# EAGLE design test1.2sch (EAGLE 9.6.2)
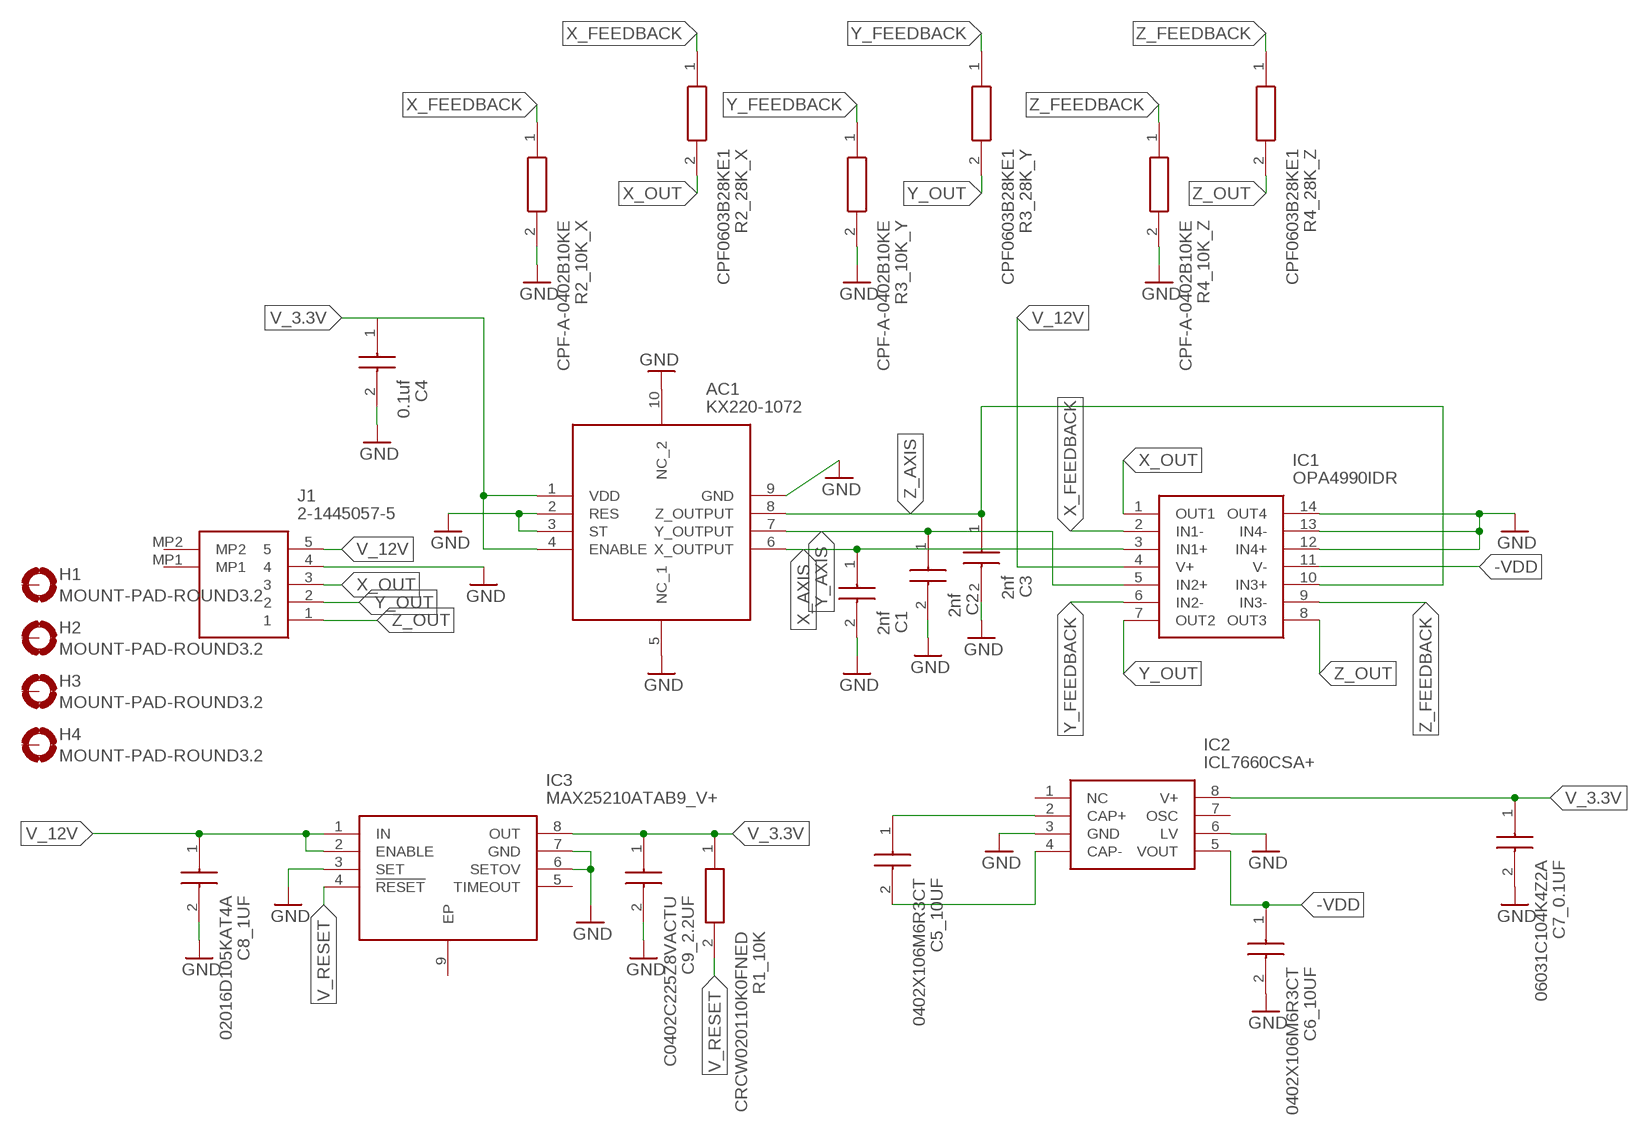
[diagram p0: schematic, sheet 1]

## Parts
AC1  KX220-1072  [KX2201072]
C1  2nf  C0402C202J3GACTU  [CAPC1005X60N]
C2  2nf  C0402C202J3GACTU  [CAPC1005X60N]
C3  2nf  C0402C202J3GACTU  [CAPC1005X60N]
C4  0.1uf  06031C104K4Z2A  [CAPC1608X90N]
C5_10UF  0402X106M6R3CT  [CAPC1005X55N]
C6_10UF  0402X106M6R3CT  [CAPC1005X55N]
C7_0.1UF  06031C104K4Z2A  [CAPC1608X90N]
C8_1UF  02016D105KAT4A  [CAPC0603X33N]
C9_2.2UF  C0402C225Z8VACTU  [INDC1005X55N]
H1  MOUNT-PAD-ROUND3.2  [3,2-PAD]
H2  MOUNT-PAD-ROUND3.2  [3,2-PAD]
H3  MOUNT-PAD-ROUND3.2  [3,2-PAD]
H4  MOUNT-PAD-ROUND3.2  [3,2-PAD]
IC1  OPA4990IDR  [SOIC127P600X175-14N]
IC2  ICL7660CSA+  [SOIC127P600X175-8N]
IC3  MAX25210ATAB9_V+  [SON65P300X300X80-9N]
J1  2-1445057-5  [214450575]
R1_10K  CRCW020110K0FNED  [RESC0603X28N]
R2_10K_X  CPF-A-0402B10KE  [RESC1005X35N]
R2_28K_X  CPF0603B28KE1  [RESC1608X55N]
R3_10K_Y  CPF-A-0402B10KE  [RESC1005X35N]
R3_28K_Y  CPF0603B28KE1  [RESC1608X55N]
R4_10K_Z  CPF-A-0402B10KE  [RESC1005X35N]
R4_28K_Z  CPF0603B28KE1  [RESC1608X55N]

## Nets
-VDD: C6_10UF.1 IC1.11(V-) IC2.5(VOUT)
GND: AC1.2(RES) AC1.3(ST) AC1.5(NC_1) AC1.9(GND) AC1.10(NC_2) C1.2(C2) C2.2(C2) C3.2(C2) C4.2 C6_10UF.2 C7_0.1UF.2 C8_1UF.2 C9_2.2UF.2 IC1.12(IN4+) IC1.13(IN4-) IC1.14(OUT4) IC2.3(GND) IC2.6(LV) IC3.3(SET) IC3.6(SETOV) IC3.7(GND) J1.4 R2_10K_X.2 R3_10K_Y.2 R4_10K_Z.2
N$1: C5_10UF.1 IC2.2(CAP+)
N$2: C5_10UF.2 IC2.4(CAP-)
V_3.3V: AC1.1(VDD) AC1.4(ENABLE) C4.1 C7_0.1UF.1 C9_2.2UF.1 IC2.8(V+) IC3.8(OUT) R1_10K.1
V_12V: C8_1UF.1 IC1.4(V+) IC3.1(IN) IC3.2(ENABLE) J1.5
V_RESET: IC3.4(!RESET) R1_10K.2
X_AXIS: AC1.6(X_OUTPUT) C1.1(C1) IC1.3(IN1+)
X_FEEDBACK: IC1.2(IN1-) R2_10K_X.1 R2_28K_X.1
X_OUT: IC1.1(OUT1) J1.3 R2_28K_X.2
Y_AXIS: AC1.7(Y_OUTPUT) C2.1(C1) IC1.5(IN2+)
Y_FEEDBACK: IC1.6(IN2-) R3_10K_Y.1 R3_28K_Y.1
Y_OUT: IC1.7(OUT2) J1.2 R3_28K_Y.2
Z_AXIS: AC1.8(Z_OUTPUT) C3.1(C1) IC1.10(IN3+)
Z_FEEDBACK: IC1.9(IN3-) R4_10K_Z.1 R4_28K_Z.1
Z_OUT: IC1.8(OUT3) J1.1 R4_28K_Z.2
Unconnected: H1.B3,2(MOUNT) H2.B3,2(MOUNT) H3.B3,2(MOUNT) H4.B3,2(MOUNT) IC2.1(NC) IC2.7(OSC) IC3.5(TIMEOUT) IC3.9(EP) J1.MP1 J1.MP2

## Library data of the parts
AC1 = SamacSys_Parts:KX220-1072: MEMS ACCELEROMETERS, 40G; MEMS Sensor Output:Analogue; Measurement Axis:X, Y, Z; Acceleration Range:+/- 40g; Supply Voltage Min:1.8V; Supply Voltage Max:3.6V; Sensor Case Style:LGA; No. of Pins:10Pins; Sensitivity Typ:30mV/g; RoHS Compliant: Yes Source: Datasheet <https://componentsearchengine.com/Datasheets/1/KX220-1072.pdf>; DESCRIPTION: MEMS ACCELEROMETERS, 40G; MEMS Sensor Output:Analogue; Measurement Axis:X, Y, Z; Acceleration Range:+/- 40g; Supply Voltage Min:1.8V; Supply Voltage Max:3.6V; Sensor Case Style:LGA; No. of Pins:10Pins; Sensitivity Typ:30mV/g; RoHS Compliant: Yes; HEIGHT: 1.01mm; MANUFACTURER_NAME: Kionix; MANUFACTURER_PART_NUMBER: KX220-1072; MOUSER_PART_NUMBER: 912-KX220-1072; MOUSER_PRICE-STOCK: https://www.mouser.com/Search/Refine.aspx?Keyword=912-KX220-1072
C1-C3 = SamacSys_Parts:C0402C202J3GACTU: CAPACITOR, 0402 2000pF +/-5% 25V Source: Datasheet <https://componentsearchengine.com/Datasheets/1/C0402C202J3GACTU.pdf>; DESCRIPTION: CAPACITOR, 0402 2000pF +/-5% 25V; HEIGHT: mm; MANUFACTURER_NAME: Kemet; MANUFACTURER_PART_NUMBER: C0402C202J3GACTU; MOUSER_PART_NUMBER: 80-C0402C202J3G; MOUSER_PRICE-STOCK: https://www.mouser.com/Search/Refine.aspx?Keyword=80-C0402C202J3G
C4 C7_0.1UF = SamacSys_Parts:06031C104K4Z2A: Multilayer Ceramic Capacitors MLCC - SMD/SMT 100V .1uF X7R 0603 10% AEC-Q200 Flex Source: Datasheet <https://componentsearchengine.com/Datasheets/1/06031A100FAT2A.pdf>; DESCRIPTION: Multilayer Ceramic Capacitors MLCC - SMD/SMT 100V .1uF X7R 0603 10% AEC-Q200 Flex; HEIGHT: 0.9mm; MANUFACTURER_NAME: AVX; MANUFACTURER_PART_NUMBER: 06031C104K4Z2A; MOUSER_PART_NUMBER: 581-06031C104K4Z2A; MOUSER_PRICE-STOCK: https://www.mouser.co.uk/ProductDetail/AVX/06031C104K4Z2A?qs=rI7uf1IzohSnOGTrilMFWw%3D%3D
C5_10UF C6_10UF = SamacSys_Parts:0402X106M6R3CT: Multilayer Ceramic Capacitors MLCC - SMD/SMT 10uF 20% 6.3 Volts 0402 Source: Datasheet; DESCRIPTION: Multilayer Ceramic Capacitors MLCC - SMD/SMT 10uF 20% 6.3 Volts 0402; HEIGHT: 0.55mm; MANUFACTURER_NAME: Walsin Technology Corporation; MANUFACTURER_PART_NUMBER: 0402X106M6R3CT; MOUSER_PART_NUMBER: 791-0402X106M6R3CT; MOUSER_PRICE-STOCK: https://www.mouser.co.uk/ProductDetail/Walsin/0402X106M6R3CT?qs=K66U1JmYfS7Y7bXr0va0Xw%3D%3D
C8_1UF = SamacSys_Parts:02016D105KAT4A: Multilayer Ceramic Capacitors MLCC - SMD/SMT 6.3V 1uF X5R 0201 10% Source: Datasheet <https://www.mouser.in/datasheet/2/40/AVX_cx5r_776519-1853698.pdf>; DESCRIPTION: Multilayer Ceramic Capacitors MLCC - SMD/SMT 6.3V 1uF X5R 0201 10%; HEIGHT: 0.33mm; MANUFACTURER_NAME: AVX; MANUFACTURER_PART_NUMBER: 02016D105KAT4A; MOUSER_PART_NUMBER: 581-02016D105KAT4A; MOUSER_PRICE-STOCK: https://www.mouser.co.uk/ProductDetail/AVX/02016D105KAT4A?qs=T3oQrply3y8%2FZ%2Fz47d2kJg%3D%3D
C9_2.2UF = SamacSys_Parts:C0402C225Z8VACTU: Multilayer Ceramic Capacitors MLCC - SMD/SMT 10V 2.2uF Y5V 0402 -20/80% Source: Datasheet <https://api.kemet.com/component-edge/download/specsheet/C0402C225Z8VACTU.pdf>; DESCRIPTION: Multilayer Ceramic Capacitors MLCC - SMD/SMT 10V 2.2uF Y5V 0402 -20/80%; HEIGHT: 0.55mm; MANUFACTURER_NAME: Kemet; MANUFACTURER_PART_NUMBER: C0402C225Z8VACTU; MOUSER_PART_NUMBER: 80-C0402C225Z8VACTU; MOUSER_PRICE-STOCK: https://www.mouser.co.uk/ProductDetail/KEMET/C0402C225Z8VACTU?qs=hzBznG4dWXVeQFTH2ftYGg%3D%3D
H1-H4 = holes:MOUNT-PAD-ROUND: MOUNTING PAD, round
IC1 = SamacSys_Parts:OPA4990IDR: Operational Amplifiers - Op Amps Quad 1MHz, 40-V rail-to-rail input/output, low-offset-voltage, low-power op amp 14-SOIC -40 to 125 Source: Datasheet <https://www.ti.com/lit/gpn/OPA4990>; DESCRIPTION: Operational Amplifiers - Op Amps Quad 1MHz, 40-V rail-to-rail input/output, low-offset-voltage, low-power op amp 14-SOIC -40 to 125; HEIGHT: 1.75mm; MANUFACTURER_NAME: Texas Instruments; MANUFACTURER_PART_NUMBER: OPA4990IDR; MOUSER_PART_NUMBER: 595-OPA4990IDR; MOUSER_PRICE-STOCK: https://www.mouser.co.uk/ProductDetail/Texas-Instruments/OPA4990IDR?qs=P1JMDcb91o5ndpCpWVI9pQ%3D%3D
IC2 = SamacSys_Parts:ICL7660CSA+: ICL7660CSA+, Charge Pump Inverting, Step Up, -10 to -1.5, 3 to 20V, 8-Pin, SOIC Source: Datasheet <http://datasheets.maximintegrated.com/en/ds/ICL7660-MAX1044.pdf>; DESCRIPTION: ICL7660CSA+, Charge Pump Inverting, Step Up, -10 to -1.5, 3 to 20V, 8-Pin, SOIC; HEIGHT: 1.75mm; MANUFACTURER_NAME: Maxim Integrated; MANUFACTURER_PART_NUMBER: ICL7660CSA+; MOUSER_PART_NUMBER: 700-ICL7660CSA; MOUSER_PRICE-STOCK: https://www.mouser.co.uk/ProductDetail/Maxim-Integrated/ICL7660CSA%2b?qs=0Y9aZN%252BMVCVqwTxC6NHmYg%3D%3D
IC3 = SamacSys_Parts:MAX25210ATAB9_V+: Linear Voltage Regulators ATO707, High Voltage LDO in P90D Source: Datasheet <https://pdfserv.maximintegrated.com/en/ds/MAX25210.pdf>; DESCRIPTION: Linear Voltage Regulators ATO707, High Voltage LDO in P90D; HEIGHT: 0.8mm; MANUFACTURER_NAME: Maxim Integrated; MANUFACTURER_PART_NUMBER: MAX25210ATAB9/V+; MOUSER_PART_NUMBER: 700-MAX25210ATAB9/V+; MOUSER_PRICE-STOCK: https://www.mouser.co.uk/ProductDetail/Maxim-Integrated/MAX25210ATAB9-V%2b?qs=W%2FMpXkg%252BdQ6hnxbux6MIyA%3D%3D
J1 = SamacSys_Parts:2-1445057-5: Pin & Socket Connectors HDR ASSY 4 POS R/A SINGLE ROW TIN Source: Datasheet <https://componentsearchengine.com/Datasheets/1/2-1445057-5.pdf>; DESCRIPTION: Pin & Socket Connectors HDR ASSY 4 POS R/A SINGLE ROW TIN; HEIGHT: 5.67mm; MANUFACTURER_NAME: TE Connectivity; MANUFACTURER_PART_NUMBER: 2-1445057-5; MOUSER_PART_NUMBER: 571-2-1445057-5; MOUSER_PRICE-STOCK: https://www.mouser.com/Search/Refine.aspx?Keyword=571-2-1445057-5
R1_10K = SamacSys_Parts:CRCW020110K0FNED: Thick Film Resistors - SMD 1/20watt 10Kohms 1% 200ppm Source: Datasheet <http://www.vishay.com/docs/20035/dcrcwe3.pdf>; DESCRIPTION: Thick Film Resistors - SMD 1/20watt 10Kohms 1% 200ppm; HEIGHT: 0.28mm; MANUFACTURER_NAME: Vishay; MANUFACTURER_PART_NUMBER: CRCW020110K0FNED; MOUSER_PART_NUMBER: 71-CRCW0201-10K; MOUSER_PRICE-STOCK: https://www.mouser.co.uk/ProductDetail/Vishay-Dale/CRCW020110K0FNED?qs=IQLUlsvFoXuh7T4rhkKYcQ%3D%3D
R2_10K_X R3_10K_Y R4_10K_Z = SamacSys_Parts:CPF-A-0402B10KE: Thin Film Resistors - SMD CPF A 0402 10K 0.1% 25PPM 5K RL Source: Datasheet; DESCRIPTION: Thin Film Resistors - SMD CPF A 0402 10K 0.1% 25PPM 5K RL; HEIGHT: 0.35mm; MANUFACTURER_NAME: TE Connectivity; MANUFACTURER_PART_NUMBER: CPF-A-0402B10KE; MOUSER_PART_NUMBER: 279-CPF-A-0402B10KE; MOUSER_PRICE-STOCK: https://www.mouser.co.uk/ProductDetail/TE-Connectivity/CPF-A-0402B10KE?qs=chTDxNqvsylKAYqdSmBV8A%3D%3D
R2_28K_X R3_28K_Y R4_28K_Z = SamacSys_Parts:CPF0603B28KE1: TE Connectivity CPF Series Precision Thin Film Surface Mount Fixed Resistor 0603 Case 28k +/-0.1% 0.063W +/-25ppm/C Source: Datasheet; DESCRIPTION: TE Connectivity CPF Series Precision Thin Film Surface Mount Fixed Resistor 0603 Case 28k +/-0.1% 0.063W +/-25ppm/C; HEIGHT: 0.55mm; MANUFACTURER_NAME: TE Connectivity; MANUFACTURER_PART_NUMBER: CPF0603B28KE1

## Net classes
0 default: width 0.254 mm, drill 0.254 mm, clearance 0.254 mm

## Board
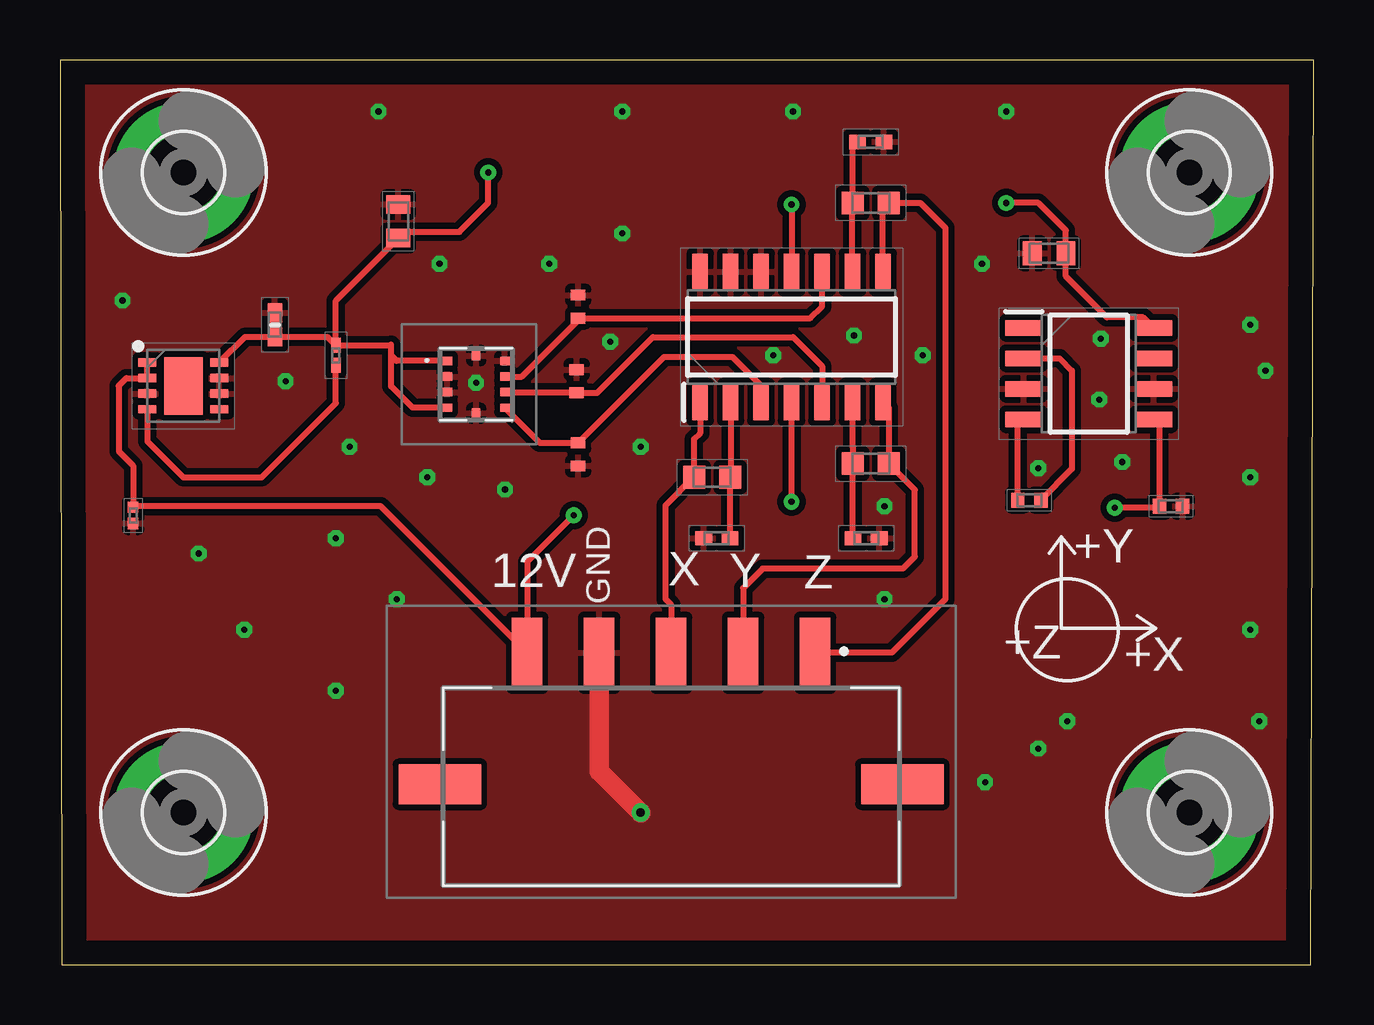
[diagram p1: board, top side]
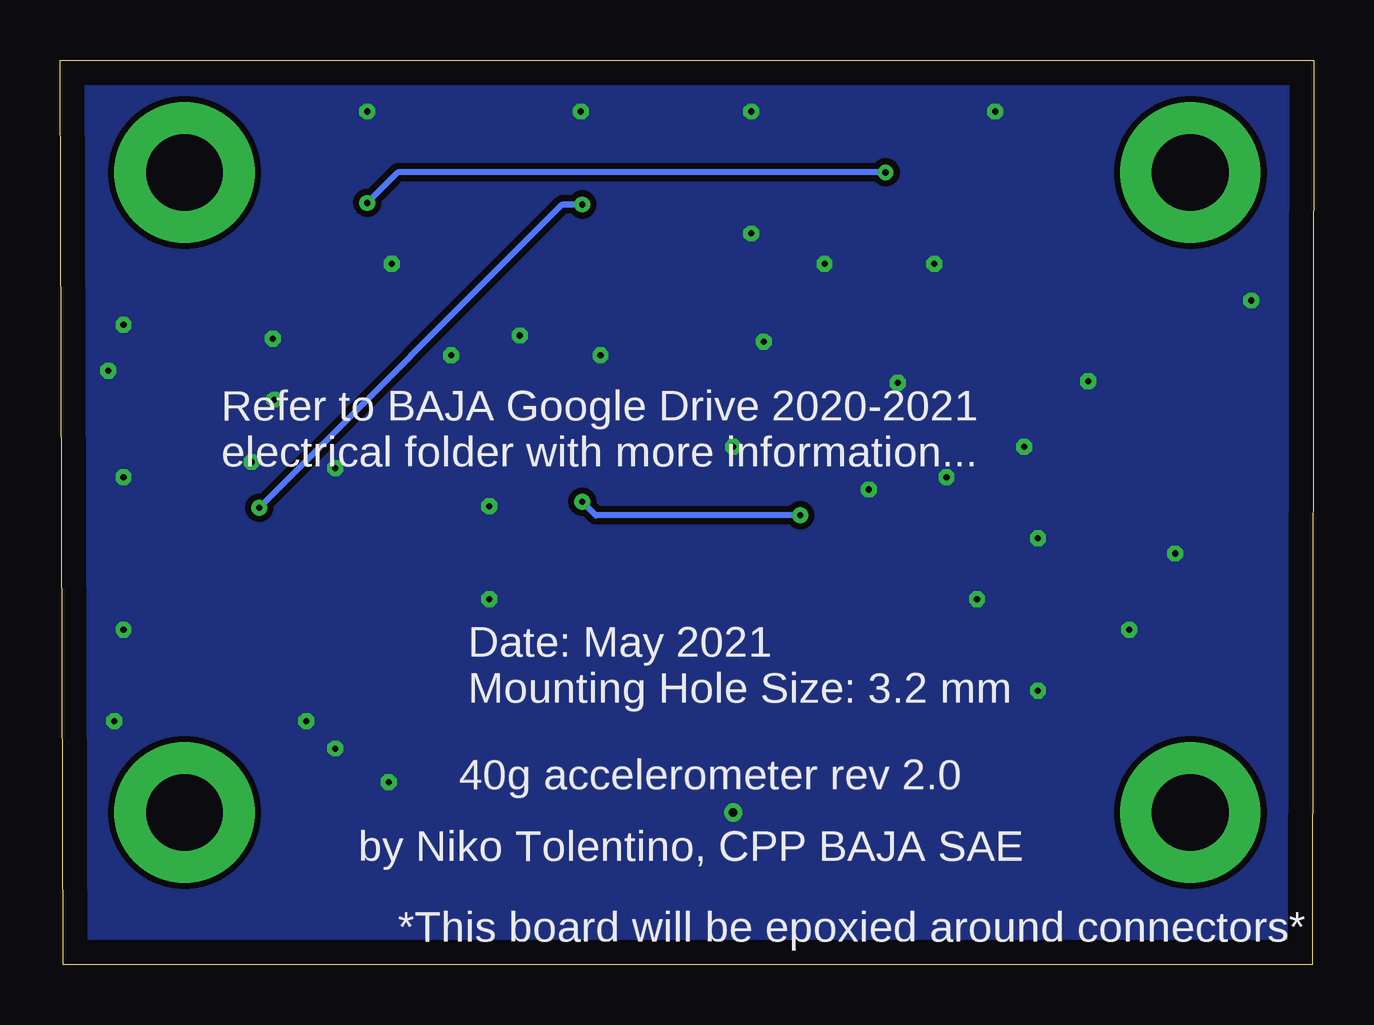
[diagram p2: board, bottom side, seen from below]

Size 52.24 x 37.71 mm. Coordinates in mm from the lower left corner, seen from the top.
Outline: 0.06,0 52.11,0 52.24,37.71 0,37.71 0.06,0
Copper layers (1*16): Top 0.035mm / dielectric 1.5mm / Bottom 0.035mm
Design rules "default *": minimum track width 6mil, minimum drill 0.25mm, track to track 6mil, track to pad 6mil, pad to pad 6mil, via to via 6mil, smd to smd 6mil, copper to edge 40mil, drill to drill 6mil, minimum pad ring 10mil, minimum via ring 8mil, stop-mask expansion 4mil, vias tented up to drill 20mil, thermal gap 10mil

### Footprints (pad centres in the part's own frame; a part is rotated, then mirrored left to right if it is on the bottom)
KX2201072 = smd 0.4 x 0.35: 1 -1.2,0.975; 2 -1.2,0.325; 3 -1.2,-0.325; 4 -1.2,-0.975; 6 1.2,-0.975; 7 1.2,-0.325; 8 1.2,0.325; 9 1.2,0.975 | smd 0.35 x 0.4: 5 0,-1.2; 10 0,1.2
CAPC1005X60N = smd 0.457 x 0.61: 1 -0.483,0; 2 0.483,0
CAPC1608X90N = smd 0.78 x 0.99: 1 -0.7,0; 2 0.7,0
CAPC1005X55N = smd 0.56 x 0.62: 1 -0.48,0; 2 0.48,0
CAPC0603X33N = smd 0.47 x 0.44: 1 -0.335,0; 2 0.335,0
INDC1005X55N = smd 0.8 x 0.6: 1 -0.5,0; 2 0.5,0
3,2-PAD = drill 3.2 pad 5.842: B3,2 0,0
SOIC127P600X175-14N = smd 1.525 x 0.65: 1 -2.712,3.81; 2 -2.712,2.54; 3 -2.712,1.27; 4 -2.712,0; 5 -2.712,-1.27; 6 -2.712,-2.54; 7 -2.712,-3.81; 8 2.712,-3.81; 9 2.712,-2.54; 10 2.712,-1.27; 11 2.712,0; 12 2.712,1.27; 13 2.712,2.54; 14 2.712,3.81
SOIC127P600X175-8N = smd 1.525 x 0.65: 1 -2.712,1.905; 2 -2.712,0.635; 3 -2.712,-0.635; 4 -2.712,-1.905; 5 2.712,-1.905; 6 2.712,-0.635; 7 2.712,0.635; 8 2.712,1.905
SON65P300X300X80-9N = smd 0.75 x 0.35: 1 -1.5,0.975; 2 -1.5,0.325; 3 -1.5,-0.325; 4 -1.5,-0.975; 5 1.5,-0.975; 6 1.5,-0.325; 7 1.5,0.325; 8 1.5,0.975 | smd 1.6 x 2.4: 9 0,0
214450575 = smd 1.27 x 2.92: 1 6,4.12; 2 3,4.12; 3 0,4.12; 4 -3,4.12; 5 -6,4.12 | smd 3.43 x 1.65: MP1 9.635,-1.36; MP2 -9.635,-1.36
RESC0603X28N = smd 0.625 x 0.4: 1 -0.412,0; 2 0.412,0
RESC1005X35N = smd 0.7 x 0.6: 1 -0.55,0; 2 0.55,0
RESC1608X55N = smd 0.9 x 0.95: 1 -0.75,0; 2 0.75,0

### Placement (x,y rotation side)
AC1  17.34,24.19 0 top
C1  21.59,21.27 270 top
C2  21.53,24.32 90 top
C3  21.59,27.43 90 top
C4  14.1,30.99 90 top
C5_10UF  40.39,19.37 180 top
C6_10UF  46.29,19.11 0 top
C7_0.1UF  41.21,29.65 180 top
C8_1UF  3.05,18.73 270 top
C9_2.2UF  8.95,26.67 90 top
H1  47.05,33.02 0 top
H2  5.14,6.35 0 top
H3  5.14,33.02 0 top
H4  47.05,6.35 0 top
IC1  30.48,26.16 90 top
IC2  42.86,24.64 0 top
IC3  5.14,24.13 0 top
J1  25.46,8.89 0 top
R1_10K  11.49,25.4 270 top
R2_10K_X  27.37,17.78 180 top
R2_28K_X  27.18,20.32 180 top
R3_10K_Y  33.59,17.78 0 top
R3_28K_Y  33.78,20.89 0 top
R4_10K_Z  33.78,34.29 0 top
R4_28K_Z  33.78,31.75 0 top

### Tracks (layer width: path | path; a pad name or v marks a point on that pad's centre or on a via)
-VDD  (via drill 0.25)
  Top 0.254: IC2.5 45.81,22.5 C6_10UF.1 45.75,19.05 v43.94,19.05 | v30.48,31.69 IC1.11
  Bottom 0.254: v43.94,19.05 31.31,31.69 v30.48,31.69
GND  (via drill 0.25, 0.35)
  Top 0.813: J1.4 22.46,8.08 v24.19,6.35
  other vias: 11.49,11.43 7.68,13.97 14.03,15.24 11.49,17.78 49.59,13.97 49.59,20.32 50.23,24.77 49.59,26.67 9.4,24.32 15.3,20.32 22.92,25.97 18.54,19.81 17.34,24.26 33.08,26.23 43.37,26.1 40.77,9.02 2.6,27.69 15.81,29.21 23.43,30.48 41.97,10.16 49.97,10.16 38.54,7.62 13.27,35.56 23.43,35.56 39.43,35.56 44.26,20.95 29.72,25.4 24.19,21.59 43.31,23.56 34.35,15.24 20.38,29.21 5.78,17.14 30.54,35.56 35.94,25.4 34.35,19.11 40.77,20.7 38.42,29.21 12.06,21.59
  pour Top: -1.14,38.61 -1.14,-0.76 53.47,-0.76 53.47,38.61
  pour Bottom: -2.35,39.88 -2.35,-2.03 54.74,-2.03 54.74,39.88
N$1
  Top 0.254: IC2.2 41.66,25.27 42.16,24.77 42.16,20.67 C5_10UF.1
N$2
  Top 0.254: C5_10UF.2 39.91,22.49 IC2.4
V_3.3V  (via drill 0.25)
  Top 0.254: IC3.8 7.71,26.17 C9_2.2UF.1 11.14,26.17 R1_10K.1 | AC1.4 14.69,23.22 13.8,24.11 13.8,25.4 | 13.8,25.4 13.8,25.84 13.77,25.81 R1_10K.1 | IC2.8 45.13,26.99 43.62,26.99 41.91,28.7 C7_0.1UF.1 41.91,30.61 40.77,31.75 v39.43,31.75 | R1_10K.1 11.49,27.68 C4.1 14.35,30.54 16.64,30.54 17.84,31.75 v17.84,33.02 | 13.8,25.4 14.03,25.17 AC1.1
  Bottom 0.254: v39.43,31.75 38.16,33.02 v17.84,33.02
V_12V  (via drill 0.25)
  Top 0.254: IC3.1 IC3.2 2.77,24.45 2.44,24.13 2.45,21.41 3.05,20.81 C8_1UF.1 3.09,19.11 13.36,19.11 J1.5 19.46,16.8 v21.4,18.73 | v30.48,19.3 IC1.4
  Bottom 0.254: v30.48,19.3 29.91,18.73 v21.4,18.73
V_RESET
  Top 0.254: IC3.4 3.64,21.82 5.14,20.32 8.4,20.32 11.49,23.41 R1_10K.2
X_AXIS
  Top 0.254: AC1.6 20,21.75 C1.1 25.17,25.34 28,25.34 29.21,24.13 IC1.3
X_FEEDBACK
  Top 0.254: R2_10K_X.1 R2_28K_X.1 27.94,20.33 IC1.2
X_OUT
  Top 0.254: IC1.1 26.67,22.16 26.42,21.91 26.42,20.33 | 26.42,20.33 R2_28K_X.2 | 26.42,20.33 25.23,19.15 25.23,15.24 25.46,15.01 J1.3
Y_AXIS
  Top 0.254: AC1.7 21.5,23.87 C2.1 22.38,23.84 24.7,26.16 30.54,26.16 31.75,24.96 IC1.5
Y_FEEDBACK
  Top 0.254: IC1.6 33.02,21.59 33.03,21.58 R3_28K_Y.1 R3_10K_Y.1
Y_OUT
  Top 0.254: IC1.7 34.53,23.21 R3_28K_Y.2 35.62,19.8 35.62,17.02 35.12,16.51 29.27,16.51 28.46,15.7 J1.2
Z_AXIS
  Top 0.254: AC1.8 19.25,24.52 21.59,26.86 C3.1 31.27,26.95 31.75,27.43 IC1.10
Z_FEEDBACK
  Top 0.254: IC1.9 33.02,31.74 R4_28K_Z.1 33.03,34.09 R4_10K_Z.1
Z_OUT
  Top 0.254: IC1.8 34.29,31.51 R4_28K_Z.2 35.85,31.75 36.89,30.71 36.89,15.24 34.66,13.01 J1.1

### Text on the board
tPlace: +Y | 12V | X | Y | Z | GND | +Z | +X
bPlace: Refer to BAJA Google Drive 2020-2021 / electrical folder with more information... | Date: May 2021 / Mounting Hole Size: 3.2 mm | 40g accelerometer rev 2.0 | by Niko Tolentino, CPP BAJA SAE | *This board will be epoxied around connectors*